# EAGLE schematic mrna_badge_v1.2 (EAGLE 7.6.0)
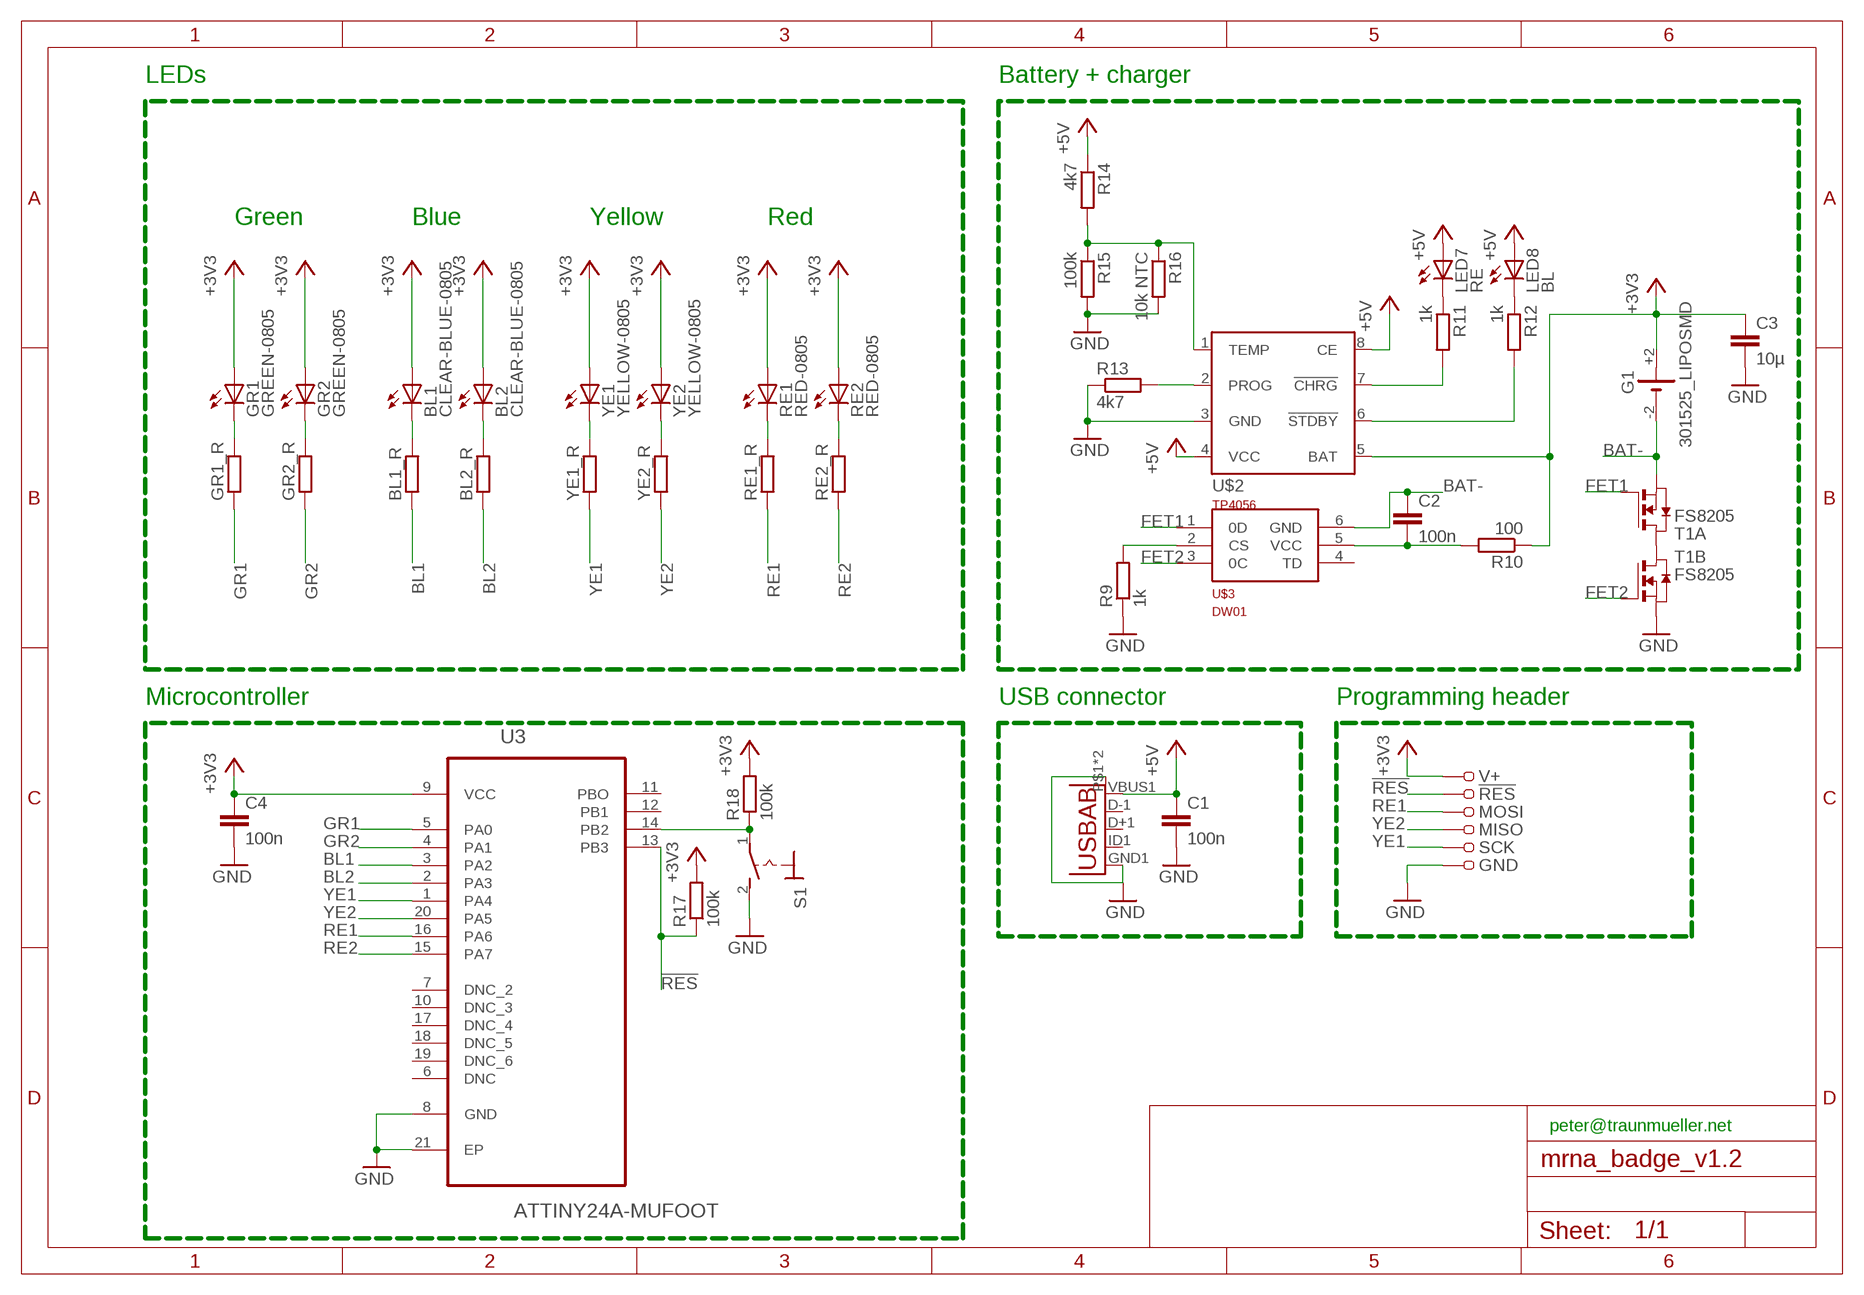
[diagram p0: schematic, sheet 1]

## Parts
!RES  0.7MM_POGO-PINSPADS  [0.7MM_SMD_PADS]
BL1  CLEAR-BLUE-0805  LEDCHIPLED_0805  [CHIPLED_0805]
BL1_R  R-EU_R0402  [R0402]
BL2  CLEAR-BLUE-0805  LEDCHIPLED_0805  [CHIPLED_0805]
BL2_R  R-EU_R0402  [R0402]
C1  100n  C-EUC0402K  [C0402K]
C2  100n  C-EUC0402K  [C0402K]
C3  10µ  C-EUC0805K  [C0805K]
C4  100n  C-EUC0402K  [C0402K]
G1  301525_LIPOSMD  [301525_LIPO_SMDCONTACTS]
GND  0.7MM_POGO-PINSPADS  [0.7MM_SMD_PADS]
GR1  GREEN-0805  LEDCHIPLED_0805  [CHIPLED_0805]
GR1_R  R-EU_R0402  [R0402]
GR2  GREEN-0805  LEDCHIPLED_0805  [CHIPLED_0805]
GR2_R  R-EU_R0402  [R0402]
LED7  RE  LEDCHIPLED_0603  [CHIPLED_0603]
LED8  BL  LEDCHIPLED_0603  [CHIPLED_0603]
MISO  0.7MM_POGO-PINSPADS  [0.7MM_SMD_PADS]
MOSI  0.7MM_POGO-PINSPADS  [0.7MM_SMD_PADS]
R9  1k  R-EU_R0402  [R0402]
R10  100  R-EU_R0402  [R0402]
R11  1k  R-EU_R0402  [R0402]
R12  1k  R-EU_R0402  [R0402]
R13  4k7  R-EU_R0402  [R0402]
R14  4k7  R-EU_R0402  [R0402]
R15  100k  R-EU_R0402  [R0402]
R16  10k NTC  R-EU_R0805  [R0805]
R17  100k  R-EU_R0402  [R0402]
R18  100k  R-EU_R0402  [R0402]
RE1  RED-0805  LEDCHIPLED_0805  [CHIPLED_0805]
RE1_R  R-EU_R0402  [R0402]
RE2  RED-0805  LEDCHIPLED_0805  [CHIPLED_0805]
RE2_R  R-EU_R0402  [R0402]
S1  TS-1088NOHOLES  [TS-1088_NOHOLES]
SCK  0.7MM_POGO-PINSPADS  [0.7MM_SMD_PADS]
T1  FS8205  DMN3024LSD  [TSSOP-8]
U2  USB""  [USB-MICRO-SMD]
U3  ATTINY24A-MUFOOT  [QFN50P400X400X80-21N_FOOTPRINT]
U$2  TP4056ESOP  [ESOP23-8]
U$3  DW01  [SOT23-6]
V+  0.7MM_POGO-PINSPADS  [0.7MM_SMD_PADS]
YE1  YELLOW-0805  LEDCHIPLED_0805  [CHIPLED_0805]
YE1_R  R-EU_R0402  [R0402]
YE2  YELLOW-0805  LEDCHIPLED_0805  [CHIPLED_0805]
YE2_R  R-EU_R0402  [R0402]

## Nets
3V3: BL1.A BL2.A C3.1 C4.1 G1.+2(+) GR1.A GR2.A R10.1 R17.2 R18.2 RE1.A RE2.A U3.9(VCC) U$2.5(BAT) V+.P$1 YE1.A YE2.A ; supply symbol labelled +3V3
!RES: !RES.P$1 R17.1 U3.13(PB3)
+5V: C1.1 LED7.A LED8.A R14.1 U2.VBUS1(VBUS) U$2.4(VCC) U$2.8(CE)
BAT-: C2.1 G1.-2(-) T1.2(A:S) T1.3(A:S) U$3.6(GND)
BL1: BL1_R.1 U3.3(PA2)
BL2: BL2_R.1 U3.2(PA3)
BUTTON: R18.1 S1.1(P) U3.14(PB2)
FET1: T1.4(A:G) U$3.1(0D)
FET2: T1.5(B:G) U$3.3(0C)
GND: C1.2 C3.2 C4.2 GND.P$1 R9.1 R13.1 R15.2 R16.2 S1.2(S) T1.6(B:S) T1.7(B:S) U2.GND1(GND) U2.P$1(CASE) U2.P$2(CASE) U3.8(GND) U3.21(EP) U$2.3(GND)
GR1: GR1_R.1 U3.5(PA0)
GR2: GR2_R.1 U3.4(PA1)
N$1: GR1.C GR1_R.2
N$3: GR2.C GR2_R.2
N$4: BL1.C BL1_R.2
N$5: BL2.C BL2_R.2
N$6: YE1.C YE1_R.2
N$7: YE2.C YE2_R.2
N$8: RE1.C RE1_R.2
N$9: RE2.C RE2_R.2
N$19: T1.1(A:D) T1.8(B:D)
N$20: R9.2 U$3.2(CS)
N$21: C2.2 R10.2 U$3.5(VCC)
N$22: R13.2 U$2.2(PROG)
N$23: LED7.C R11.1
N$24: LED8.C R12.1
N$25: R12.2 U$2.6(!STDBY)
N$26: R11.2 U$2.7(!CHRG)
N$27: R14.2 R15.1 R16.1 U$2.1(TEMP)
RE1: MOSI.P$1 RE1_R.1 U3.16(PA6)
RE2: RE2_R.1 U3.15(PA7)
YE1: SCK.P$1 U3.1(PA4) YE1_R.1
YE2: MISO.P$1 U3.20(PA5) YE2_R.1
Unconnected: U2.D+1(D+) U2.D-1(D-) U2.ID1(USBID) U3.6(DNC) U3.7(DNC_2) U3.10(DNC_3) U3.11(PBO) U3.12(PB1) U3.17(DNC_4) U3.18(DNC_5) U3.19(DNC_6) U$3.4(TD)

## Notes on the sheet
- LEDs | Battery + charger
- Green | Blue | Yellow | Red
- Microcontroller | USB connector | Programming header
- peter@traunmueller.net

## Library data of the parts
!RES GND MISO MOSI SCK V+ = pinhead:0.7MM_POGO-PINS: PIN HEADER
BL1 BL2 GR1 GR2 LED7 LED8 RE1 RE2 YE1 YE2 = led:LED: LED OSRAM: - CHIPLED LG R971, LG N971, LY N971, LG Q971, LY Q971, LO R971, LY R971 LH N974, LH R974 LS Q976, LO Q976, LY Q976 LO Q996 - Hyper CHIPLED LW Q18S LB Q993, LB Q99A, LB R99A - SideLED LS A670, LO A670, LY A670, LG A670, LP A670 LB A673, LV A673, LT A673, LW A673 LH A674 LY A675 LS A676, LA A676, LO A676, LY A676, LW A676 LS A679, LY A679, LG A679 - Hyper Micro SIDELED® LS Y876, LA Y876, LO Y876, LY Y876 LT Y87S - SmartLED LW L88C, LW L88S LB L89C, LB L89S, LG L890 LS L89K, LO L89K, LY L89K LS L896, LA L896, LO L896, LY L896 - TOPLED LS T670, LO T670, LY T670, LG T670, LP T670 LSG T670, LSP T670, LSY T670, LOP T670, LYG T670 LG T671, LOG T671, LSG T671 LB T673, LV T673, LT T673, LW T673 LH T674 LS T676, LA T676, LO T676, LY T676, LB T676, LH T676, LSB T676, LW T676 LB T67C, LV T67C, LT T67C, LS T67K, LO T67K, LY T67K, LW E67C LS E67B, LA E67B, LO E67B, LY E67B, LB E67C, LV E67C, LT E67C LW T67C LS T679, LY T679, LG T679 LS T770, LO T770, LY T770, LG T770, LP T770 LB T773, LV T773, LT T773, LW T773 LH T774 LS E675, LA E675, LY E675, LS T675 LS T776, LA T776, LO T776, LY T776, LB T776 LHGB T686 LT T68C, LB T68C - Hyper Mini TOPLED® LB M676 - Mini TOPLED Santana® LG M470 LS M47K, LO M47K, LY M47K Source: http://www.osram.convergy.de LUXEON: - LUMILED® LXK2-PW12-R00, LXK2-PW12-S00, LXK2-PW14-U00, LXK2-PW14-V00 LXK2-PM12-R00, LXK2-PM12-S00, LXK2-PM14-U00 LXK2-PE12-Q00, LXK2-PE12-R00, LXK2-PE12-S00, LXK2-PE14-T00, LXK2-PE14-U00 LXK2-PB12-K00, LXK2-PB12-L00, LXK2-PB12-M00, LXK2-PB14-N00, LXK2-PB14-P00, LXK2-PB14-Q00 LXK2-PR12-L00, LXK2-PR12-M00, LXK2-PR14-Q00, LXK2-PR14-R00 LXK2-PD12-Q00, LXK2-PD12-R00, LXK2-PD12-S00 LXK2-PH12-R00, LXK2-PH12-S00 LXK2-PL12-P00, LXK2-PL12-Q00, LXK2-PL12-R00 Source: www.luxeon.com KINGBRIGHT: KA-3528ASYC Source: www.kingbright.com
BL1_R BL2_R GR1_R GR2_R R9-R18 RE1_R RE2_R YE1_R YE2_R = rcl:R-EU_: RESISTOR, European symbol
C1-C4 = rcl:C-EU: CAPACITOR, European symbol
G1 = battery:301525_LIPO: LI BATTERY Sonnenschein
S1 = switch:TS-1088: TOGGLE SWITCH Button TS-1088 https://lcsc.com/product-detail/Tactile-Switches_XUNPU-TS-1088-AR02016_C720477.html/?href=jlc-SMT https://lcsc.com/product-detail/Tactile-Switches_Korean-Hroparts-Elec-K2-1807SA-B4DW-06_C223822.html LCSC (JLCPCB): C720477 LCSC (JLCPCB): C223822
T1 = FS8205A:DMN3024LSD: DUAL N-CHANNEL ENHANCEMENT MODE MOSFET data sheet <http://goo.gl/dRgboR> Dave.Calaway Eagle Library <https://goo.gl/Muy1Tr>
U2 = MicroUSB:USB: This is a USB AB connector that is compatible with USB OTG. i.e. this connector can serve as a host or device
U3 = Atmel_By_element14_Batch_1-00:ATTINY24A-MU: Microcontroller
U$2 = TP4056:TP4056: TP4056 Data sheet <http://goo.gl/J7k8TF> Dave.Calaway Eagle Library <https://goo.gl/Muy1Tr>
U$3 = DW01:DW01: The DW01-P battery protection IC is designed to protect lithium-ion/polymer battery from damage or degrading the lifetime due to overcharge, overdischarge, and/or overcurrent for one-cell lithium-ion/polymer battery powered systems, such as cellular phones. Data sheet <http://goo.gl/4y108d> Dave.Calaway Eagle Library <https://goo.gl/Muy1Tr>